# Altium schematic sheet CartSimple.SCHDOC
size B
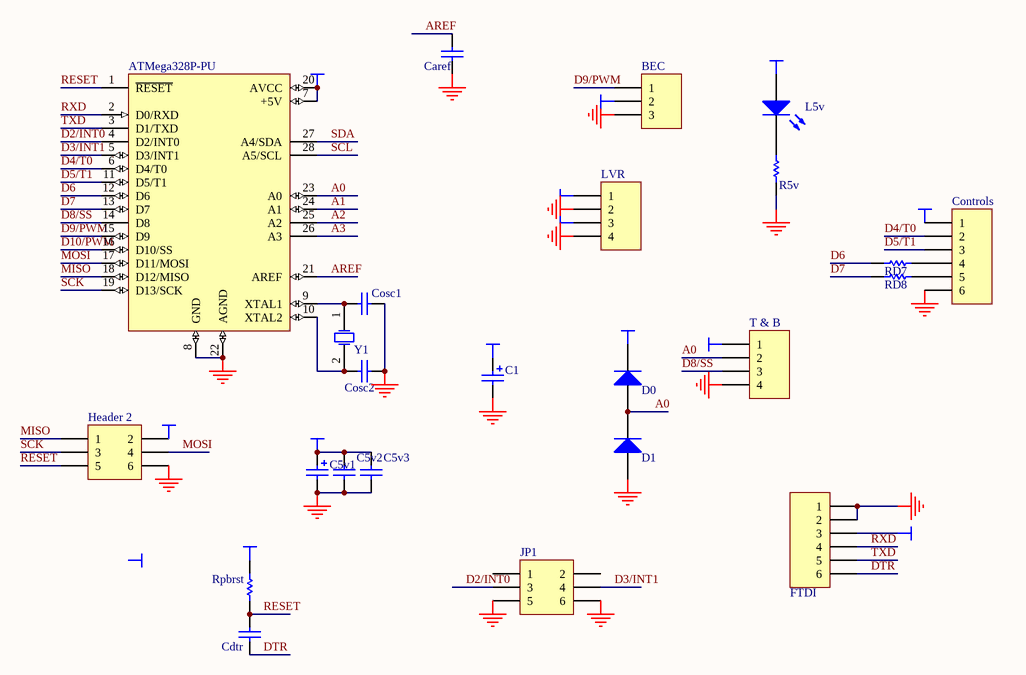
[diagram p0: CartSimple.SCHDOC]

## Parts
ATMega328P-PU  Atmel ATMega328  [DIP 28]  (value not drawn)
BEC  Header 3  [Header 3way 2.54]  (value not drawn)
C1  Cap Pol1  [Electrolytic Capacitor 8mm]  (value not drawn)
C5v1  Cap Pol1  [Electrolytic Capacitor 8mm]  (value not drawn)
C5v2  Cap  [Capacitor 5mm]  (value not drawn)
C5v3  Cap  [Capacitor 5mm]  (value not drawn)
Caref  Cap  [Capacitor 5mm]  (value not drawn)
Cdtr  Cap  [Capacitor 5mm]  (value not drawn)
Controls  Header 6  [Header 6way 2.54]  (value not drawn)
Cosc1  Cap  [Capacitor 5mm]  (value not drawn)
Cosc2  Cap  [Capacitor 5mm]  (value not drawn)
D0  Diode  [Signal Diode]  (value not drawn)
D1  Diode  [Signal Diode]  (value not drawn)
FTDI  Header 6  [Header 6]  (value not drawn)
Header_2  Header 3X2  [Header 2x3]  (value not drawn)
JP1  Header 3X2  [Header 2x3]  (value not drawn)
L5v  LED0  [Led 3mm]  (value not drawn)
LVR  Header 4  [SOT-223]  (value not drawn)
R5v  Res1  [1/4W Resistor]  (value not drawn)
RD7  Res1  [1/4W Resistor]  (value not drawn)
RD8  Res1  [1/4W Resistor]  (value not drawn)
Rpbrst  Res1  [1/4W Resistor]  (value not drawn)
T_&_B  Header 4  [Header 4way 2.54]  (value not drawn)
Y1  16MHz XTAL  [Crystal]  (value not drawn)

## Nets
+5: ATMega328P-PU.7(+5V) ATMega328P-PU.20(AVCC) C5v1.1 C5v2.1 C5v3.1 Controls.1 D0.2(K) FTDI.3 Header_2.2 L5v.1(A) LVR.1 Rpbrst.2 T_&_B.1
GND: ATMega328P-PU.8(GND) ATMega328P-PU.22(AGND) BEC.3 C1.2 C5v1.2 C5v2.2 C5v3.2 Caref.2 Controls.6 Cosc1.2 Cosc2.2 D1.1(A) FTDI.1 FTDI.2 Header_2.6 JP1.5 JP1.6 LVR.2 LVR.4 R5v.1 T_&_B.4
VCC: BEC.2 C1.1 LVR.3
A0: ATMega328P-PU.23(A0) D0.1(A) D1.2(K) T_&_B.2
A1: ATMega328P-PU.24(A1)
A2: ATMega328P-PU.25(A2)
A3: ATMega328P-PU.26(A3)
AREF: ATMega328P-PU.21(AREF) Caref.1
D2/INT0: ATMega328P-PU.4(D2/INT0) JP1.3
D3/INT1: ATMega328P-PU.5(D3/INT1) JP1.4
D4/T0: ATMega328P-PU.6(D4/T0) Controls.2
D5/T1: ATMega328P-PU.11(D5/T1) Controls.3
D6: ATMega328P-PU.12(D6) RD7.2
D7: ATMega328P-PU.13(D7) RD8.2
D8/SS: ATMega328P-PU.14(D8) T_&_B.3
D9/PWM: ATMega328P-PU.15(D9) BEC.1
D10/PWM: ATMega328P-PU.16(D10/SS)
DTR: Cdtr.2 FTDI.6
MISO: ATMega328P-PU.18(D12/MISO) Header_2.1
MOSI: ATMega328P-PU.17(D11/MOSI) Header_2.4
RESET: ATMega328P-PU.1(~{RESET}) Cdtr.1 Header_2.5 Rpbrst.1
RXD: ATMega328P-PU.2(D0/RXD) FTDI.4
SCK: ATMega328P-PU.19(D13/SCK) Header_2.3
SCL: ATMega328P-PU.28(A5/SCL)
SDA: ATMega328P-PU.27(A4/SDA)
TXD: ATMega328P-PU.3(D1/TXD) FTDI.5
NetATMega328P-PU_9: ATMega328P-PU.9(XTAL1) Cosc1.1 Y1.1(OSC1)
NetATMega328P-PU_10: ATMega328P-PU.10(XTAL2) Cosc2.1 Y1.2(OSC2)
NetControls_4: Controls.4 RD7.1
NetControls_5: Controls.5 RD8.1
NetL5v_2: L5v.2(K) R5v.2

Not connected (* = marked no-connect by the designer): JP1 1 2

## Notes on the sheet
- Labels drawn without touching a wire or pin: +5

## Library data of the parts
ATMega328P-PU = PIC16C55-10/SS: EPROM-Based 8-Bit CMOS Microcontroller; Part Number: ATMega 328P-PU; Package Information: Latest Revision: 1998; Note: T0CKI (pin 2) must be tied to VSS or VDD, if not in use, to reduce current consumption; Published: 8-Jun-2000; Revision: July-2002: Re-released for DXP Platform.; Datasheet: Latest Revision: 1998; Package Reference: SS28; Publisher: Altium Limited; Manufacturer: Atmel; Class I: Microcontroller; Class II: 8-bit
BEC = Header 3: Header, 3-Pin; Manufacturer: Generic Components; Class I: Connector; Revision: July-2002: Re-released for DXP Platform.; Publisher: Altium Limited
C1 C5v1 = Cap Pol1: Polarized Capacitor (Radial); Manufacturer: Generic Components; Class I: Passive; Value: 470uF; Published: 8-Jun-2000; Revision: July-2002: Re-released for DXP Platform.; Publisher: Altium Limited; Class II: Capacitor
C5v2 C5v3 = Cap: Capacitor; Manufacturer: Generic Components; Class I: Passive; Value: 1uF; Published: 8-Jun-2000; Revision: July-2002: Re-released for DXP Platform.; Publisher: Altium Limited; Class II: Capacitor
Caref Cdtr = Cap: Capacitor; Manufacturer: Generic Components; Class I: Passive; Value: 0.1uF; Published: 8-Jun-2000; Revision: July-2002: Re-released for DXP Platform.; Publisher: Altium Limited; Class II: Capacitor
Controls FTDI = Header 6: Header, 6-Pin; Manufacturer: Generic Components; Class I: Connector; Revision: July-2002: Re-released for DXP Platform.; Publisher: Altium Limited
Cosc1 = Cap: Capacitor; Manufacturer: Generic Components; Class I: Passive; Value: 560pF; Published: 8-Jun-2000; Revision: July-2002: Re-released for DXP Platform.; Publisher: Altium Limited; Class II: Capacitor
Cosc2 = Cap: Capacitor; Manufacturer: Generic Components; Class I: Passive; Value: 22pF; Published: 8-Jun-2000; Revision: July-2002: Re-released for DXP Platform.; Publisher: Altium Limited; Class II: Capacitor
D0 D1 = Diode: Default Diode; Manufacturer: Generic Components; Class I: Discrete; Class II: Diode - Switching; Published: 8-Jun-2000; Revision: July-2002: Re-released for DXP Platform.; Publisher: Altium Limited
Header_2 JP1 = Header 3X2: Header, 3-Pin, Dual row; Manufacturer: Generic Components; Class I: Connector; Revision: July-2002: Re-released for DXP Platform.; Publisher: Altium Limited
L5v = LED0: Typical INFRARED GaAs LED; Manufacturer: Multicomp; Class I: Optoelectronic; Published: 8-Jun-2000; Revision: July-2002: Re-released for DXP Platform.; Publisher: Altium Limited; Class II: LED; Part Number: OVL-3328
LVR T_&_B = Header 4: Header, 4-Pin; Manufacturer: Generic Components; Class I: Connector; Revision: July-2002: Re-released for DXP Platform.; Publisher: Altium Limited
R5v = Res1: Resistor; Manufacturer: Generic Components; Class I: Passive; Value: 1.2K; Published: 8-Jun-2000; Revision: July-2002: Re-released for DXP Platform.; Publisher: Altium Limited; Class II: Resistor
RD7 RD8 = Res1: Resistor; Manufacturer: Generic Components; Class I: Passive; Value: 560; Published: 8-Jun-2000; Revision: July-2002: Re-released for DXP Platform.; Publisher: Altium Limited; Class II: Resistor
Rpbrst = Res1: Resistor; Manufacturer: Generic Components; Class I: Passive; Value: 47K; Published: 8-Jun-2000; Revision: July-2002: Re-released for DXP Platform.; Publisher: Altium Limited; Class II: Resistor
Y1 = XTAL: Crystal Oscillator; Manufacturer: Raltron; Part Number: AS-16.000-18; Published: 8-Jun-2000; Revision: July-2002: Re-released for DXP Platform.; Publisher: Altium Limited; Class I: Oscillator; Class II: Crystal Oscillator